# Altium schematic sheet CM5_GPIO.SchDoc
size A4; SheetNumber: 2; SheetTotal: 3
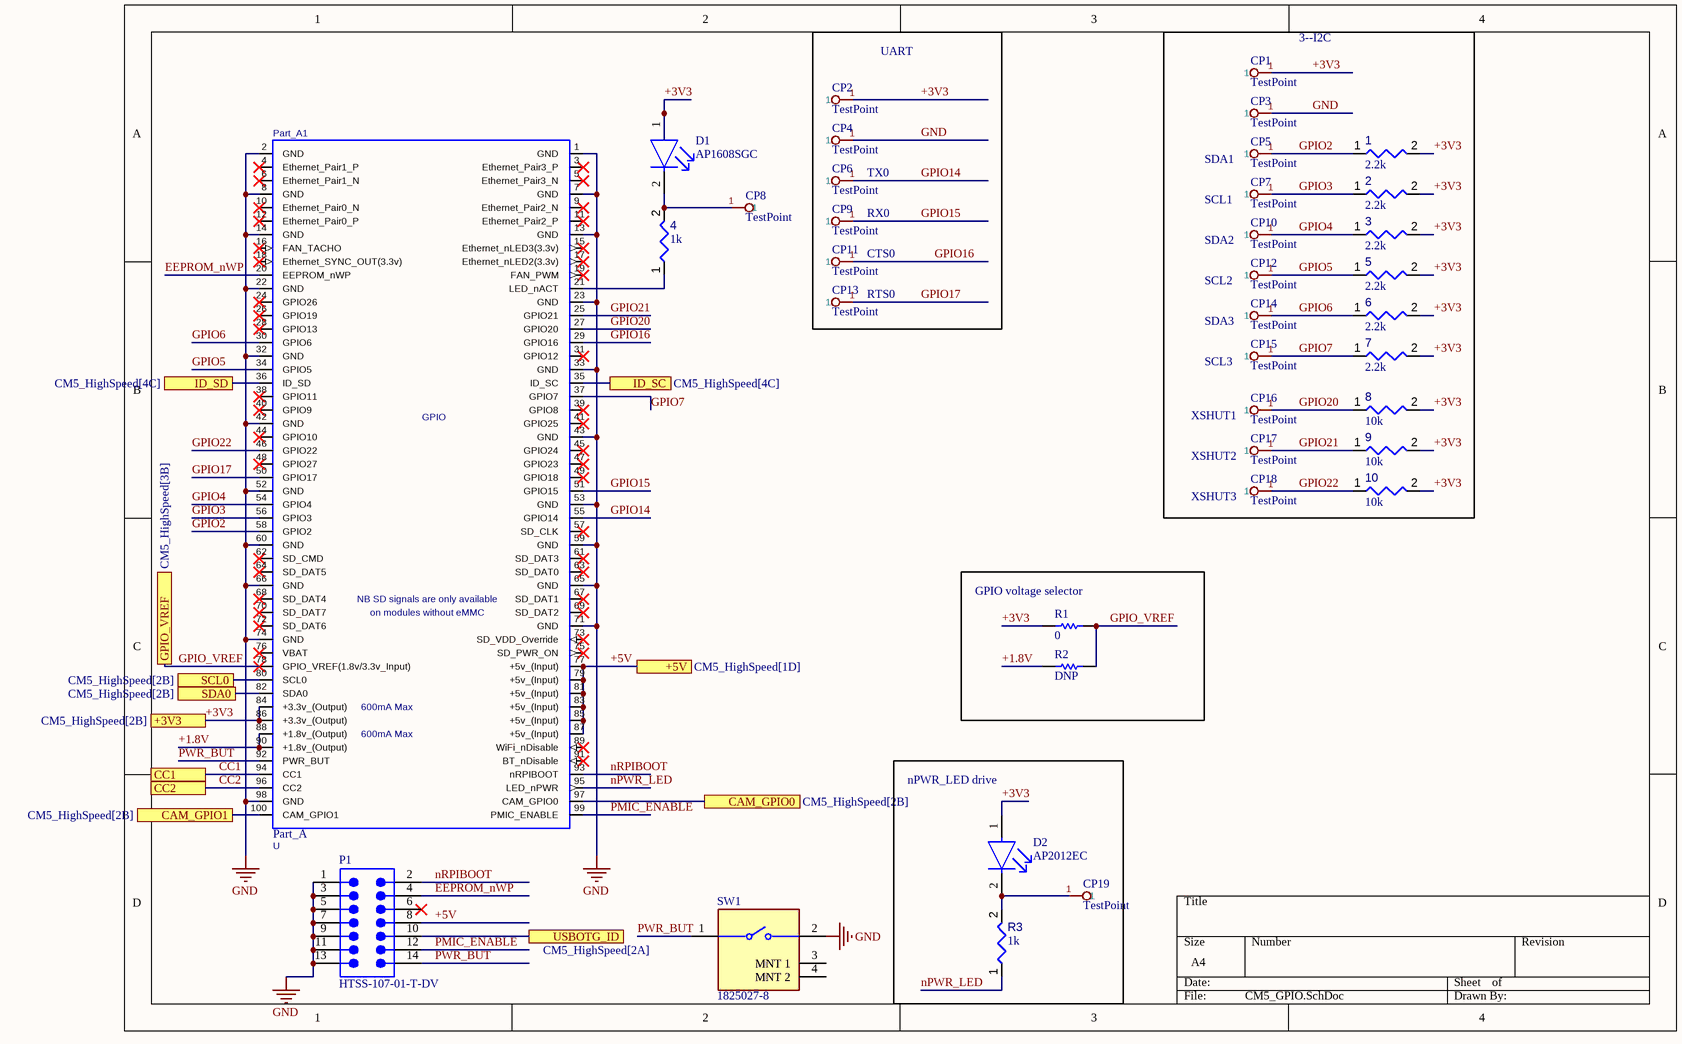
[diagram p0: CM5_GPIO.SchDoc]

## Parts
1  value 2.2k  [RESC0402(1005)_L]  (hidden comment: Resistor 2K2  +/-5 % 0402 63 mW)
2  value 2.2k  [RESC0402(1005)_L]  (hidden comment: Resistor 2K2  +/-5 % 0402 63 mW)
3  value 2.2k  [RESC0402(1005)_L]  (hidden comment: Resistor 2K2  +/-5 % 0402 63 mW)
4  value 1k  [RESC0402(1005)_L]  (hidden comment: 1KR2J)
5  value 2.2k  [RESC0402(1005)_L]  (hidden comment: Resistor 2K2  +/-5 % 0402 63 mW)
6  value 2.2k  [RESC0402(1005)_L]  (hidden comment: Resistor 2K2  +/-5 % 0402 63 mW)
7  value 2.2k  [RESC0402(1005)_L]  (hidden comment: Resistor 2K2  +/-5 % 0402 63 mW)
8  value 10k  [RESC1005X40X25ML05T05]  (hidden comment: Resistor 10k +/-1% 0402 63 mW)
9  value 10k  [RESC1005X40X25ML05T05]  (hidden comment: Resistor 10k +/-1% 0402 63 mW)
10  value 10k  [RESC1005X40X25ML05T05]  (hidden comment: Resistor 10k +/-1% 0402 63 mW)
CP1  TestPoint  [TestPoint-Footprint-1]
CP2  TestPoint  [TestPoint-Footprint-1]
CP3  TestPoint  [TestPoint-Footprint-1]
CP4  TestPoint  [TestPoint-Footprint-1]
CP5  TestPoint  [TestPoint-Footprint-1]
CP6  TestPoint  [TestPoint-Footprint-1]
CP7  TestPoint  [TestPoint-Footprint-1]
CP8  TestPoint  [TestPoint-Footprint-1]
CP9  TestPoint  [TestPoint-Footprint-1]
CP10  TestPoint  [TestPoint-Footprint-1]
CP11  TestPoint  [TestPoint-Footprint-1]
CP12  TestPoint  [TestPoint-Footprint-1]
CP13  TestPoint  [TestPoint-Footprint-1]
CP14  TestPoint  [TestPoint-Footprint-1]
CP15  TestPoint  [TestPoint-Footprint-1]
CP16  TestPoint  [TestPoint-Footprint-1]
CP17  TestPoint  [TestPoint-Footprint-1]
CP18  TestPoint  [TestPoint-Footprint-1]
CP19  TestPoint  [TestPoint-Footprint-1]
D1  AP1608SGC  [FP-AP1608SGC-MFG]
D2  AP2012EC  [FP-AP2012EC-MFG]
P1  HTSS-107-01-T-DV  [SMTC-HTSS-107-01-X-DV]
Part_A1  Part_A  Reference: U  [AMPHENOL_10164227-1004A1RLF]
R1  value 0  [RESC1005X40X25ML05T10]  (hidden comment: Resistor 0R 0402 63 mW)
R2  value DNP  [RESC1005X40X25ML05T10]  (hidden comment: Resistor 0R 0402 63 mW)
R3  value 1k  [RESC0402(1005)_L]  (hidden comment: 1KR2J)
SW1  1825027-8  [FP-1825027-8-MFG]

## Blocks framed on the sheet
GPIO voltage selector: R1 R2
nPWR_LED drive: CP19 D2 R3

## Ports
+3V3 (see CM5_HighSpeed[2B]), +5V (see CM5_HighSpeed[1D]), CAM_GPIO0 (see CM5_HighSpeed[2B]), CAM_GPIO1 (see CM5_HighSpeed[2B]), CC1, CC2, GPIO_VREF (see CM5_HighSpeed[3B]), ID_SC (see CM5_HighSpeed[4C]), ID_SD (see CM5_HighSpeed[4C]), SCL0 (see CM5_HighSpeed[2B]), SDA0 (see CM5_HighSpeed[2B]), USBOTG_ID (see CM5_HighSpeed[2A])

## Nets
GND: CP3.1 CP4.1 P1.1 P1.3 P1.5 P1.7 P1.9 P1.11 P1.13 Part_A1.1(GND) Part_A1.2(GND) Part_A1.7(GND) Part_A1.8(GND) Part_A1.13(GND) Part_A1.14(GND) Part_A1.22(GND) Part_A1.23(GND) Part_A1.32(GND) Part_A1.33(GND) Part_A1.42(GND) Part_A1.43(GND) Part_A1.52(GND) Part_A1.53(GND) Part_A1.59(GND) Part_A1.60(GND) Part_A1.65(GND) Part_A1.66(GND) Part_A1.71(GND) Part_A1.74(GND) Part_A1.98(GND) SW1.2
+1.8V: Part_A1.88(+1.8v_(Output)) Part_A1.90(+1.8v_(Output)) R2.1
+3V3: 1.2 2.2 3.2 5.2 6.2 7.2 8.2 9.2 10.2 CP1.1 CP2.1 D1.1(A) D2.1(A) Part_A1.84(+3.3v_(Output)) Part_A1.86(+3.3v_(Output)) R1.1 ; port +3V3
+5V: P1.8 Part_A1.77(+5v_(Input)) Part_A1.79(+5v_(Input)) Part_A1.81(+5v_(Input)) Part_A1.83(+5v_(Input)) Part_A1.85(+5v_(Input)) Part_A1.87(+5v_(Input)) ; port +5V
CAM_GPIO0: Part_A1.97(CAM_GPIO0) ; port CAM_GPIO0
CAM_GPIO1: Part_A1.100(CAM_GPIO1) ; port CAM_GPIO1
CC1: Part_A1.94(CC1) ; port CC1
CC2: Part_A1.96(CC2) ; port CC2
EEPROM_nWP: P1.4 Part_A1.20(EEPROM_nWP)
GPIO2: 1.1 CP5.1 Part_A1.58(GPIO2)
GPIO3: 2.1 CP7.1 Part_A1.56(GPIO3)
GPIO4: 3.1 CP10.1 Part_A1.54(GPIO4)
GPIO5: 5.1 CP12.1 Part_A1.34(GPIO5)
GPIO6: 6.1 CP14.1 Part_A1.30(GPIO6)
GPIO7: 7.1 CP15.1 Part_A1.37(GPIO7)
GPIO14: CP6.1 Part_A1.55(GPIO14)
GPIO15: CP9.1 Part_A1.51(GPIO15)
GPIO16: CP11.1 Part_A1.29(GPIO16)
GPIO17: CP13.1 Part_A1.50(GPIO17)
GPIO20: 8.1 CP16.1 Part_A1.27(GPIO20)
GPIO21: 9.1 CP17.1 Part_A1.25(GPIO21)
GPIO22: 10.1 CP18.1 Part_A1.46(GPIO22)
GPIO_VREF: Part_A1.78(GPIO_VREF(1.8v/3.3v_Input)) R1.2 R2.2 ; port GPIO_VREF
ID_SC: Part_A1.35(ID_SC) ; port ID_SC
ID_SD: Part_A1.36(ID_SD) ; port ID_SD
nPWR_LED: Part_A1.95(LED_nPWR) R3.1
nRPIBOOT: P1.2 Part_A1.93(nRPIBOOT)
PMIC_ENABLE: P1.12 Part_A1.99(PMIC_ENABLE)
PWR_BUT: P1.14 Part_A1.92(PWR_BUT) SW1.1
SCL0: Part_A1.80(SCL0) ; port SCL0
SDA0: Part_A1.82(SDA0) ; port SDA0
USBOTG_ID: P1.10 ; port USBOTG_ID
Net4_1: 4.1 Part_A1.21(LED_nACT)
Net4_2: 4.2 CP8.1 D1.2(C)
NetCP19_1: CP19.1 D2.2(C) R3.2

Not connected (* = marked no-connect by the designer): P1 6*; Part_A1 3(Ethernet_Pair3_P)* 4(Ethernet_Pair1_P)* 5(Ethernet_Pair3_N)* 6(Ethernet_Pair1_N)* 9(Ethernet_Pair2_N)* 10(Ethernet_Pair0_N)* 11(Ethernet_Pair2_P)* 12(Ethernet_Pair0_P)* 15(Ethernet_nLED3(3.3v))* 16(FAN_TACHO)* 17(Ethernet_nLED2(3.3v))* 18(Ethernet_SYNC_OUT(3.3v))* 19(FAN_PWM)* 24(GPIO26)* 26(GPIO19)* 28(GPIO13)* 31(GPIO12)* 38(GPIO11)* 39(GPIO8)* 40(GPIO9)* 41(GPIO25)* 44(GPIO10)* 45(GPIO24)* 47(GPIO23)* 48(GPIO27)* 49(GPIO18)* 57(SD_CLK)* 61(SD_DAT3)* 62(SD_CMD)* 63(SD_DAT0)* 64(SD_DAT5)* 67(SD_DAT1)* 68(SD_DAT4)* 69(SD_DAT2)* 70(SD_DAT7)* 72(SD_DAT6)* 73(SD_VDD_Override)* 75(SD_PWR_ON)* 76(VBAT)* 89(WiFi_nDisable)* 91(BT_nDisable)*; SW1 3(MNT_1) 4(MNT_2)

## Notes on the sheet
- (near CP1) 3--I2C
- UART
- TX0
- SDA1
- RX0
- SCL1
- SDA2
- CTS0
- RTS0
- SCL2
- SDA3
- (near CP15) SCL3
- XSHUT1
- XSHUT2
- (near CP18) XSHUT3
- (in symbol Part_A) GPIO; NB SD signals are only available; on modules without eMMC; 600mA Max

## Library data of the parts
1-3 5-7 = CMP-009-00166-3: Chip Resistor, 2,2 kOhms, +/-5 %, 63 mW, -55 to 155 degC, 0402; Power: 63mW; Tolerance: 5%; Pins: 2; Min Operating Temperature: -55°C; Max Operating Temperature: 155°C; Case/Package: 0402
4 R3 = CMP-009-00075-2: 1K 0.063W 5% 0402 (1005 Metric)  SMD; Power: 63mW; Pins: 2; Mounting Technology: SMT; Case/Package: 0402; Tolerance: 5%
8-10 = CMP-009-00019-5: Chip Resistor, 10 KOhm, +/- 1%, 63 mW, -55 to 155 degC, 0402 (1005 Metric); Power: 63mW; Voltage Rating: 50V; Case/Package: 0402; Mounting Technology: SM; Pins: 2; Min Operating Temperature: -55°C; Tolerance: 1%; RoHS Compliant: True; Max Operating Temperature: 155°C
CP1-CP19 = CMP-011-000005-2: Design Item ID: TestPoint; Source: CM5_GPIO.SchLib
D1 = CMP-44529-000023-1: Standard LEDs - SMD GREEN WATER CLEAR; Luminous Intensity: 15mcd; Wavelength: 568nm; Forward Voltage: 2.2V; Forward Current: 20mA; Viewing Angle: 120°; Min Operating Temperature: -40°C; Mount: Surface Mount; Case/Package: 0603; Package Quantity: 2000; Lens Style: Clear; Illumination Color: Green; Packaging: Tape and Reel; Color: Green; Lead Free: Lead Free; Lens Color: Clear; Max Operating Temperature: 85°C
D2 = CMP-44529-000070-1: LED RED CLEAR SMD; Forward Voltage: 2V; Test Current: 20mA; Luminous Intensity: 15mcd; Viewing Angle: 120°; Wavelength: 627nm; Dominant Wavelength: 625nm; Lead Free: Lead Free; Length: 2mm; Forward Current: 20mA; Mount: Surface Mount; Packaging: Tape and Reel; Illumination Color: Red; Color: Red; Height: 1.1mm; Case Code (Metric): 2012; Case Code (Imperial): 0805; Case/Package: 0805; Width: 1.25mm; RoHS Compliant: Yes; Package Quantity: 2000; Min Operating Temperature: -40°C; Max Operating Temperature: 85°C; Lens Style: Clear
P1 = CMP-1024-00046-1: Shrouded .025" SQ Post Header, Surface Mount, Vertical, -55 to 105 degC, 2.54 mm Pitch, 14-Pin, Male, RoHS; Manufacturer: Samtec; Pitch: 2.54 mm; ComponentLink1Description: Manufacturer URL; PackageReference: HTSS-107-01-X-DV; RoHS: True; Orientation: Vertical; ComponentLink2URL: http://www.samtec.com/documents/webfiles/pdf/htss.pdf; Mounting Technology: Surface Mount; PackageVersion: Z, 7/2001; Temperature Range: -55 to 105 degC; DatasheetVersion: F-214; PackageDescription: High Temp Top Shroud; ComponentLink3URL: http://www.samtec.com/documents/webfiles/cpdf/HTSS-1XX-01-XX-DV-X-XX-X-XX-MKT.pdf; ComponentLink3Description: Package Specification; PartNumber: HTSS-107-01-T-DV; ComponentLink2Description: Datasheet; ComponentLink1URL: http://www.samtec.com
R1 = CMP-009-00004-5: Chip Resistor, 0 Ohm, 0.063 W, -55 to 155 degC, 0402 (1005 Metric); Power: 63mW; Voltage Rating: 50V; Max Operating Temperature: 155°C; Pins: 2; RoHS Compliant: True; Min Operating Temperature: -55°C; Mounting Technology: SM; Case/Package: 0402
R2 = CMP-009-00004-5: Chip Resistor, 0 Ohm, 0.063 W, -55 to 155 degC, 0402 (1005 Metric); Power: 0; Voltage Rating: 50V; Max Operating Temperature: 155°C; Pins: 2; RoHS Compliant: True; Min Operating Temperature: -55°C; Mounting Technology: SM; Case/Package: 0402
SW1 = CMP-2000-05515-2: SWITCH TACTILE SPST-NO 0.05A 24V; Manufacturer: TE Connectivity; Operating Force: 1.6N; Contact Resistance: 100mΩ; Contact Current Rating: 50mA; Electromechanical Life: 100000Cycles; Temperature: -35°C to +85°C; Lead Free: Yes; Device Class L1: Electromechanical; ComponentLink2Description: Datasheet; Temperature Range Low: -35°C; Voltage Rating Dc: 24V; RoHS: TRUE; Mount: Through Hole; Temperature Range High: +85°C; Octopart: https://octopart.com/1825027-8-te+connectivity-41891101; ComponentLink2URL: https://www.te.com/commerce/DocumentDelivery/DDEController?Action=showdoc&DocId=Customer+Drawing%7F1825027%7FG4%7Fpdf%7FEnglish%7FENG_CD_1825027_G4.pdf%7F1825027-8; Manufacturer Part Number: 1825027-8; Height: 7.31mm; Automotive: No; Mouser Description: Tactile Switches R/A TACT 160G PB SWITCH; Digikey Description: SWITCH TACTILE SPST-NO 0.05A 24V; Category: Switch; Device Class L3: Pushbutton Switches; Package: 1825027-8; Device Class L2: Switches; Throw Configuration: SPST-NO